# Altium schematic sheet Sheet_1_2025-11-09.schdoc
size 308 x 215 mm
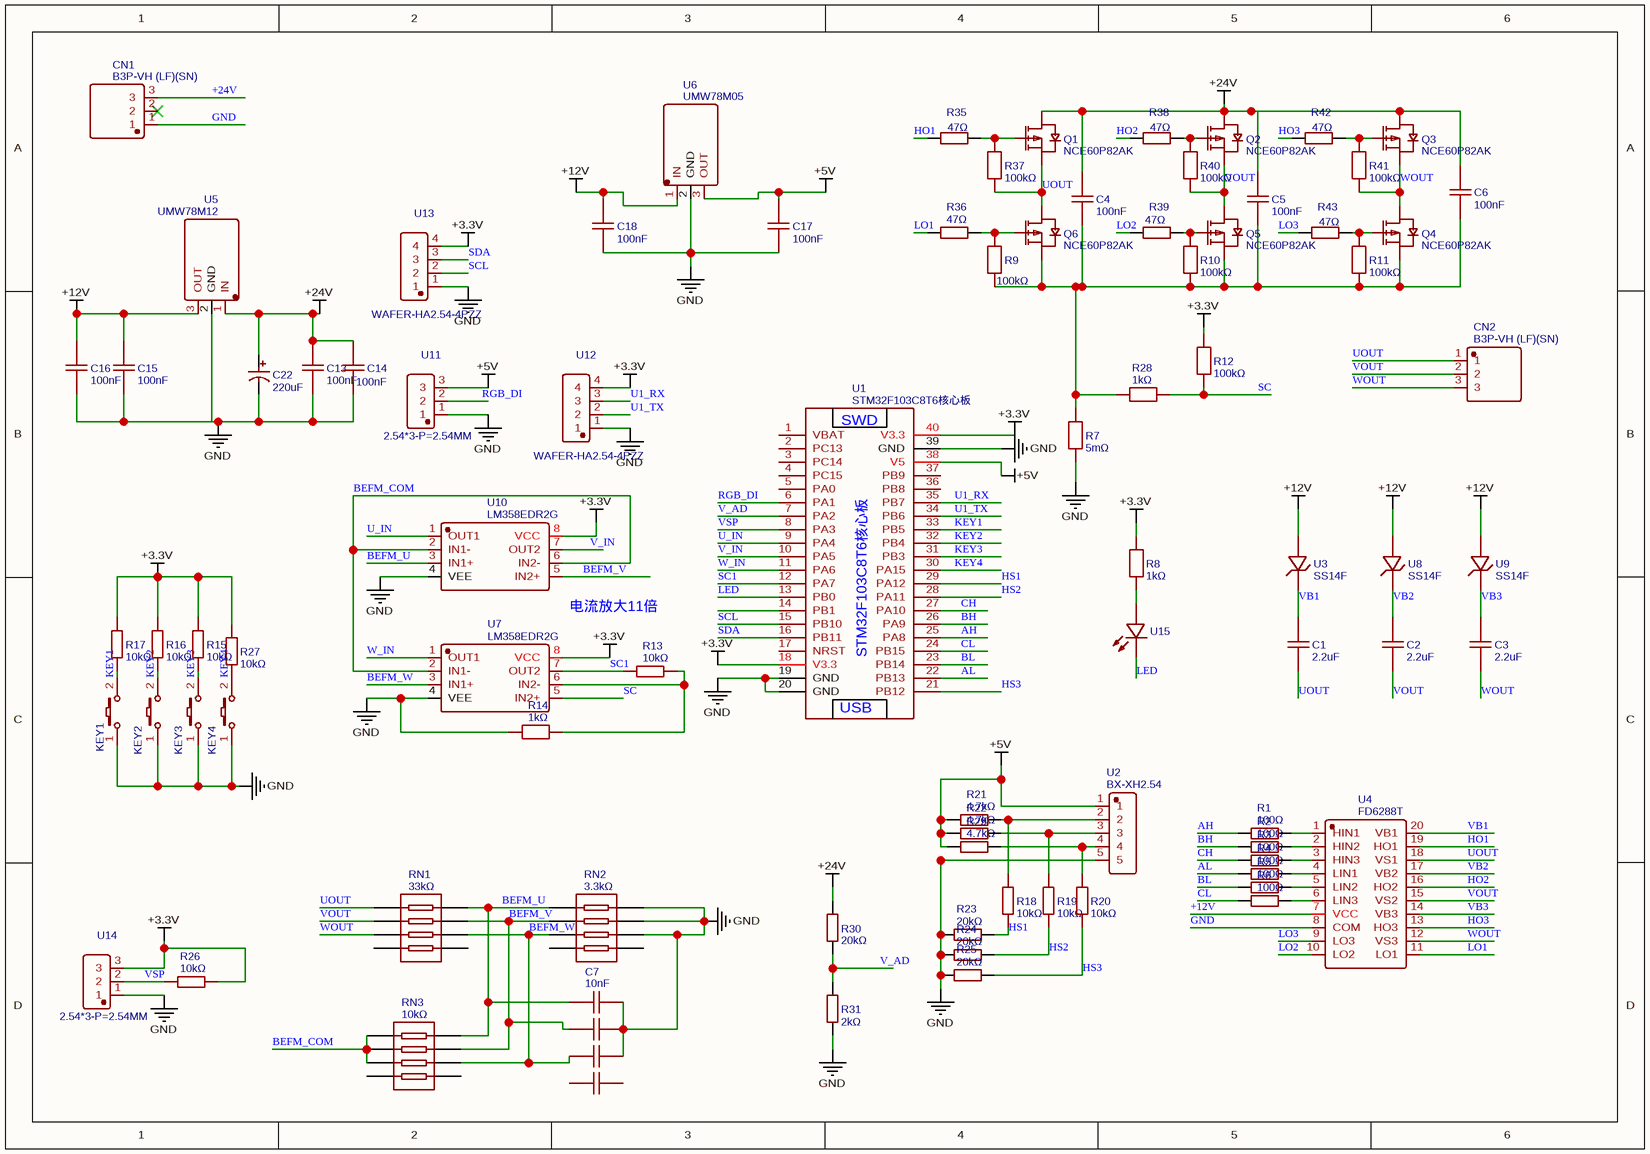
[diagram p0: Sheet_1_2025-11-09.schdoc]

## Parts
C1  2.2uF  [C0805]
C2  2.2uF  [C0805]
C3  2.2uF  [C0805]
C4  100nF  [C0603]
C5  100nF  [C0603]
C6  100nF  [C0603]
C7  10nF  [CAP-ARRAY-SMD_0612-8P-L3.40-W1.80-BL]
C13  100nF  [C0603]
C14  100nF  [C0603]
C15  100nF  [C0603]
C16  100nF  [C0603]
C17  100nF  [C0603]
C18  100nF  [C0603]
C22  220uF  [CAP-TH_BD13.0-P5.00-D1.2-FD]
CN1  B3P-VH (LF)(SN)  [CONN-TH_B3P-VH-LF-SN]
CN2  B3P-VH (LF)(SN)  [CONN-TH_B3P-VH-LF-SN]
KEY1  K2-3.6×6.1_SMD  [KEY-SMD_2P-L6.2-W3.6-LS8.0]  (value not drawn)
KEY2  K2-3.6×6.1_SMD  [KEY-SMD_2P-L6.2-W3.6-LS8.0]  (value not drawn)
KEY3  K2-3.6×6.1_SMD  [KEY-SMD_2P-L6.2-W3.6-LS8.0]  (value not drawn)
KEY4  K2-3.6×6.1_SMD  [KEY-SMD_2P-L6.2-W3.6-LS8.0]  (value not drawn)
Q1  NCE60P82AK  [TO-252-2_L6.6-W6.1-P4.57-LS10.1-BL-1]
Q2  NCE60P82AK  [TO-252-2_L6.6-W6.1-P4.57-LS10.1-BL-1]
Q3  NCE60P82AK  [TO-252-2_L6.6-W6.1-P4.57-LS10.1-BL-1]
Q4  NCE60P82AK  [TO-252-2_L6.6-W6.1-P4.57-LS10.1-BL-1]
Q5  NCE60P82AK  [TO-252-2_L6.6-W6.1-P4.57-LS10.1-BL-1]
Q6  NCE60P82AK  [TO-252-2_L6.6-W6.1-P4.57-LS10.1-BL-1]
R1  100Ω  [R0603]
R2  100Ω  [R0603]
R3  100Ω  [R0603]
R4  100Ω  [R0603]
R5  100Ω  [R0603]
R6  100Ω  [R0603]
R7  5mΩ  [R2512]
R8  1kΩ  [R0603]
R9  100kΩ  [R0603]
R10  100kΩ  [R0603]
R11  100kΩ  [R0603]
R12  100kΩ  [R0603]
R13  10kΩ  [R0603]
R14  1kΩ  [R0603]
R15  10kΩ  [R0603]
R16  10kΩ  [R0603]
R17  10kΩ  [R0603]
R18  10kΩ  [R0603]
R19  10kΩ  [R0603]
R20  10kΩ  [R0603]
R21  4.7kΩ  [R0603]
R22  4.7kΩ  [R0603]
R23  20kΩ  [R0603]
R24  20kΩ  [R0603]
R25  20kΩ  [R0603]
R26  10kΩ  [R0603]
R27  10kΩ  [R0603]
R28  1kΩ  [R0603]
R29  4.7kΩ  [R0603]
R30  20kΩ  [R0603]
R31  2kΩ  [R0603]
R35  47Ω  [R0603]
R36  47Ω  [R0603]
R37  100kΩ  [R0603]
R38  47Ω  [R0603]
R39  47Ω  [R0603]
R40  100kΩ  [R0603]
R41  100kΩ  [R0603]
R42  47Ω  [R0603]
R43  47Ω  [R0603]
RN1  33kΩ  [RES-ARRAY-SMD_0603-8P-L3.2-W1.6-BL]
RN2  3.3kΩ  [RES-ARRAY-SMD_0603-8P-L3.2-W1.6-BL]
RN3  10kΩ  [RES-ARRAY-SMD_0603-8P-L3.2-W1.6-BL]
U1  STM32F103C8T6核心板  [STM32F103C8T6核心板]
U2  BX-XH2.54  [CONN-TH_5P-P2.50_BX-XH2.54-5PZZ]
U3  SS14F  [SMAF_L3.5-W2.6-LS4.7-RD]
U4  FD6288T  [TSSOP-20_L6.5-W4.4-P0.65-LS6.4-BL]
U5  UMW78M12  [TO-252-2_L6.6-W6.1-P4.57-LS9.9-BR-CW]
U6  UMW78M05  [TO-252-2_L6.6-W6.1-P4.57-LS9.9-BR-CW]
U7  LM358EDR2G  [SOIC-8_L4.9-W3.9-P1.27-LS6.0-BL]
U8  SS14F  [SMAF_L3.5-W2.6-LS4.7-RD]
U9  SS14F  [SMAF_L3.5-W2.6-LS4.7-RD]
U10  LM358EDR2G  [SOIC-8_L4.9-W3.9-P1.27-LS6.0-BL]
U11  2.54*3-P=2.54MM  [CONN-TH_XH2.54-3P]
U12  WAFER-HA2.54-4PZZ  [CONN-TH_4P-P2.50-XH2.54-4P]
U13  WAFER-HA2.54-4PZZ  [CONN-TH_4P-P2.50-XH2.54-4P]
U14  2.54*3-P=2.54MM  [CONN-TH_XH2.54-3P]
U15  KO-0805_C9900066565  [LED0805-RD]  (value not drawn)

## Nets
+3.3V: R8.2 R12.2 R15.2 R16.2 R17.2 R26.1 R27.2 U1.18(V3.3) U1.40(V3.3) U7.8(VCC) U10.8(VCC) U12.4 U13.4 U14.3
+5V: C17.2 R21.2 R22.2 R29.2 U1.38(V5) U2.1 U6.3(OUT) U11.3
+12V: C15.2 C16.2 C18.2 U3.2(A) U4.7(VCC) U5.3(OUT) U6.1(IN) U8.2(A) U9.2(A)
+24V: C4.2 C5.2 C6.2 C13.2 C14.2 C22.1 CN1.3 Q1.2(D) Q2.2(D) Q3.2(D) R30.2 U5.1(IN)
GND: C7.2 C7.3 C7.4 C13.1 C14.1 C15.1 C16.1 C17.1 C18.1 C22.2 CN1.1 KEY1.1 KEY2.1 KEY3.1 KEY4.1 R7.1 R14.1 R23.2 R24.2 R25.2 R31.1 RN2.6 RN2.7 RN2.8 U1.19(GND) U1.20(GND) U1.39(GND) U2.5 U4.8(COM) U5.2(GND) U6.2(GND) U7.4(VEE) U10.4(VEE) U11.1 U12.1 U13.1 U14.1
AH: R1.1 U1.25(PA8)
AL: R4.1 U1.22(PB13)
BEFM_COM: RN3.5 RN3.6 RN3.7 U7.2(IN1-) U10.2(IN1-) U10.6(IN2-)
BEFM_U: C7.5 RN1.8 RN2.1 RN3.4 U10.3(IN1+)
BEFM_V: C7.6 RN1.7 RN2.2 RN3.3 U10.5(IN2+)
BEFM_W: C7.7 RN1.6 RN2.3 RN3.2 U7.3(IN1+)
BH: R2.1 U1.26(PA9)
BL: R5.1 U1.23(PB14)
CH: R3.1 U1.27(PA10)
CL: R6.1 U1.24(PB15)
HO1: R35.1 U4.19(HO1)
HO2: R38.1 U4.16(HO2)
HO3: R42.1 U4.13(HO3)
HS1: R18.1 R23.1 U1.29(PA12)
HS2: R19.1 R24.1 U1.28(PA11)
HS3: R20.1 R25.1 U1.21(PB12)
KEY1: KEY1.2 R17.1 U1.33(PB5)
KEY2: KEY2.2 R16.1 U1.32(PB4)
KEY3: KEY3.2 R15.1 U1.31(PB3)
KEY4: KEY4.2 R27.1 U1.30(PA15)
LED: U1.13(PB0) U15.1(K)
LO1: R36.1 U4.11(LO1)
LO2: R39.1 U4.10(LO2)
LO3: R43.1 U4.9(LO3)
RGB_DI: U1.6(PA1) U11.2
SC: R12.1 R28.2 U7.5(IN2+)
SC1: R13.1 U1.12(PA7) U7.7(OUT2)
SCL: U1.15(PB10) U13.2
SDA: U1.16(PB11) U13.3
U1_RX: U1.35(PB7) U12.3
U1_TX: U1.34(PB6) U12.2
U_IN: U1.9(PA4) U10.1(OUT1)
UOUT: C1.1 CN2.1 Q1.3(S) Q6.2(D) R37.1 RN1.1 U4.18(VS1)
V_AD: R30.1 R31.2 U1.7(PA2)
V_IN: U1.10(PA5) U10.7(OUT2)
VB1: C1.2 U3.1(C) U4.20(VB1)
VB2: C2.2 U4.17(VB2) U8.1(C)
VB3: C3.2 U4.14(VB3) U9.1(C)
VOUT: C2.1 CN2.2 Q2.3(S) Q5.2(D) R40.1 RN1.2 U4.15(VS2)
VSP: R26.2 U1.8(PA3) U14.2
W_IN: U1.11(PA6) U7.1(OUT1)
WOUT: C3.1 CN2.3 Q3.3(S) Q4.2(D) R41.1 RN1.3 U4.12(VS3)
NetC4_1: C4.1 C5.1 C6.1 Q4.3(S) Q5.3(S) Q6.3(S) R7.2 R9.1 R10.1 R11.1 R28.1
NetQ1_1: Q1.1(G) R35.2 R37.2
NetQ2_1: Q2.1(G) R38.2 R40.2
NetQ3_1: Q3.1(G) R41.2 R42.2
NetQ4_1: Q4.1(G) R11.2 R43.2
NetQ5_1: Q5.1(G) R10.2 R39.2
NetQ6_1: Q6.1(G) R9.2 R36.2
NetR1_2: R1.2 U4.1(HIN1)
NetR2_2: R2.2 U4.2(HIN2)
NetR3_2: R3.2 U4.3(HIN3)
NetR4_2: R4.2 U4.4(LIN1)
NetR5_2: R5.2 U4.5(LIN2)
NetR6_2: R6.2 U4.6(LIN3)
NetR8_1: R8.1 U15.2(A)
NetR13_2: R13.2 R14.2 U7.6(IN2-)
NetR18_2: R18.2 R21.1 U2.2
NetR19_2: R19.2 R22.1 U2.3
NetR20_2: R20.2 R29.1 U2.4

Not connected (* = marked no-connect by the designer): C7 1 8; CN1 2*; RN1 4 5; RN2 4 5; RN3 1 8; U1 1(VBAT) 2(PC13) 3(PC14) 4(PC15) 5(PA0) 14(PB1) 17(NRST) 36(PB8) 37(PB9)

## Notes on the sheet
- 电流放大11倍
- (near KEY1) KEY1
- (in symbol STM32F103C8T6核心板) SWD; USB

## Library data of the parts
C1-C3 = 2.2uF: Manufacturer: CCTC(三环); Manufacturer Part: TCC0805X5R225K250FT; nameAlias: Value; Contributor: lcsc; Supplier: LCSC; Supplier Part: C2903666; JLCPCB Part Class: Extended Part; spicePre: C; spiceSymbolName: TCC0805X5R225K250FT
C4-C6 = 100nF: Manufacturer: null; Manufacturer Part: CT41-0603-2F4-50V-0.1uF-M(N); nameAlias: Value; Contributor: LCSC; Supplier: LCSC; Supplier Part: C138344; JLCPCB Part Class: Extended Part; spicePre: C; spiceSymbolName: CT41-0603-2F4-50V-0.1UF-M(N)
C7 = 10nF: Manufacturer: YAGEO(国巨); Manufacturer Part: CA0612KRX7R9BB103; Contributor: LCSC; nameAlias: Value; Supplier: LCSC; Supplier Part: C700524; JLCPCB Part Class: Extended Part; link: https://so.szlcsc.com/global.html?k=C700524&ref=editor; spicePre: C; spiceSymbolName: CA0612KRX7R9BB103
C13-C18 = 100nF: Manufacturer: XINNA(新纳); Manufacturer Part: CT063X7R104KNTD; nameAlias: Value; Contributor: lcsc; Supplier: LCSC; Supplier Part: C41398819; link: https://so.szlcsc.com/global.html?k=C41398819&ref=editor; spicePre: C; spiceSymbolName: CT063X7R104KNTD
C22 = 220uF: Manufacturer: rubycon(红宝石); Manufacturer Part: 100PX220MEFC12.5X20; nameAlias: Value; Supplier: LCSC; Supplier Part: C88784; JLCPCB Part Class: Extended Part; link: https://so.szlcsc.com/global.html?k=C88784&ref=editor; spicePre: C; spiceSymbolName: 100PX220MEFC12.5X20
CN1 CN2 = B3P-VH (LF)(SN): Manufacturer: JST; Contributor: LCSC; Supplier: LCSC; Supplier Part: C160316; Manufacturer Part: B3P-VH(LF)(SN); JLCPCB Part Class: Extended Part; link: https://so.szlcsc.com/global.html?k=C160316&ref=editor; spicePre: C; spiceSymbolName: B3P-VH (LF)(SN)
KEY1-KEY4 = K2-3.6×6.1_SMD: Manufacturer Part: K2-1107ST-A4SW-06; Contributor: LCEDA_Lib; 制造商: 韩国韩荣; Supplier Part: C118141; Supplier: LCSC; spicePre: K; spiceSymbolName: K2-3.6×6.1_SMD
Q1-Q6 = NCE60P82AK: Manufacturer: NCE(无锡新洁能); Contributor: lcsc; Supplier: LCSC; Supplier Part: C2686573; Manufacturer Part: NCE60P82AK; JLCPCB Part Class: Extended Part; link: https://so.szlcsc.com/global.html?k=C2686573&ref=editor; spicePre: Q; spiceSymbolName: NCE60P82AK
R1-R6 = 100Ω: Manufacturer: UNI-ROYAL(厚声); Manufacturer Part: 0603WAF1000T5E; nameAlias: Value; Supplier: LCSC; Supplier Part: C22775; JLCPCB Part Class: Basic Part; link: https://so.szlcsc.com/global.html?k=C22775&ref=editor; spicePre: R; spiceSymbolName: 0603WAF1000T5E
R7 = 5mΩ: Manufacturer: Milliohm(毫欧); Manufacturer Part: HoLR2512-1.5W-100mR-1%-15ppm; nameAlias: Value; Contributor: LCSC; Supplier: LCSC; Supplier Part: C2885420; JLCPCB Part Class: Extended Part; spicePre: R; spiceSymbolName: HOLR2512-1.5W-100MR-1%-15PPM
R8 R28 = 1kΩ: Manufacturer: TE Connectivity(泰科电子); Manufacturer Part: CPF0603B10KE1; nameAlias: Value; Contributor: lcsc; Supplier: LCSC; Supplier Part: C4109781; JLCPCB Part Class: Extended Part; spicePre: R; spiceSymbolName: CPF0603B10KE1
R9-R11 R37 R40 R41 = 100kΩ: Manufacturer: Milliohm(毫欧); Manufacturer Part: HoAR0603-1/10W-100KR-1%-TCR25; nameAlias: Value; Contributor: lcsc; Supplier: LCSC; Supplier Part: C2912579; JLCPCB Part Class: Extended Part; spicePre: R; spiceSymbolName: HOAR0603-1/10W-100KR-1%-TCR25
R12 = 100kΩ: Manufacturer: TE Connectivity(泰科电子); Manufacturer Part: CPF0603B10KE1; nameAlias: Value; Contributor: lcsc; Supplier: LCSC; Supplier Part: C4109781; JLCPCB Part Class: Extended Part; spicePre: R; spiceSymbolName: CPF0603B10KE1
R13 R15-R20 R26 R27 = 10kΩ: Manufacturer: Tyohm(幸亚电阻); Manufacturer Part: RMC060310KFN; nameAlias: Value; Contributor: LCSC; Supplier: LCSC; Supplier Part: C269701; JLCPCB Part Class: Extended Part; link: https://so.szlcsc.com/global.html?k=C269701&ref=editor; spicePre: R; spiceSymbolName: RMC060310K1%N
R14 = 1kΩ: Manufacturer: VO(翔胜); Manufacturer Part: FCR0603F1K; nameAlias: Value; Contributor: lcsc; Supplier: LCSC; Supplier Part: C5913168; JLCPCB Part Class: Extended Part; link: https://so.szlcsc.com/global.html?k=C5913168&ref=editor; spicePre: R; spiceSymbolName: FCR0603F1K
R21 R22 R29 = 4.7kΩ: Manufacturer: UNI-ROYAL(厚声); Manufacturer Part: 0603WAF4701T5E; nameAlias: Value; Supplier: LCSC; Supplier Part: C23162; JLCPCB Part Class: Basic Part; link: https://so.szlcsc.com/global.html?k=C23162&ref=editor; spicePre: R; spiceSymbolName: 0603WAF4701T5E
R23-R25 R30 = 20kΩ: Manufacturer: UNI-ROYAL(厚声); Manufacturer Part: 0603WAF2002T5E; nameAlias: Value; Supplier: LCSC; Supplier Part: C4184; JLCPCB Part Class: Basic Part; link: https://so.szlcsc.com/global.html?k=C4184&ref=editor; spicePre: R; spiceSymbolName: 0603WAF2002T5E
R31 = 2kΩ: Manufacturer: UNI-ROYAL(厚声); Manufacturer Part: 0603WAF2001T5E; nameAlias: Value; Supplier: LCSC; Supplier Part: C22975; JLCPCB Part Class: Basic Part; link: https://so.szlcsc.com/global.html?k=C22975&ref=editor; spicePre: R; spiceSymbolName: 0603WAF2001T5E
R35 R36 R38 R39 R42 R43 = 47Ω: Manufacturer: UNI-ROYAL(厚声); Manufacturer Part: 0603WAF470JT5E; nameAlias: Value; Supplier: LCSC; Supplier Part: C23182; JLCPCB Part Class: Basic Part; link: https://so.szlcsc.com/global.html?k=C23182&ref=editor; spicePre: R; spiceSymbolName: 0603WAF470JT5E
RN1 = 33kΩ: Manufacturer: UNI-ROYAL(厚声); Manufacturer Part: 4D03WGJ0333T5E; nameAlias: Value; Supplier: LCSC; Supplier Part: C25732; JLCPCB Part Class: Extended Part; link: https://so.szlcsc.com/global.html?k=C25732&ref=editor; spicePre: R; spiceSymbolName: 4D03WGJ0333T5E
RN2 = 3.3kΩ: Manufacturer: UNI-ROYAL(厚声); Manufacturer Part: 4D03WGJ0333T5E; nameAlias: Value; Supplier: LCSC; Supplier Part: C25732; JLCPCB Part Class: Extended Part; link: https://so.szlcsc.com/global.html?k=C25732&ref=editor; spicePre: R; spiceSymbolName: 4D03WGJ0333T5E
RN3 = 10kΩ: Manufacturer: FH(风华); Manufacturer Part: RC-ML08W103JT; nameAlias: Value; Contributor: LCSC; Supplier: LCSC; Supplier Part: C69593; JLCPCB Part Class: Extended Part; link: https://so.szlcsc.com/global.html?k=C69593&ref=editor; spicePre: R; spiceSymbolName: RC-ML08W103JT
U1 = STM32F103C8T6核心板: Manufacturer: 无; Manufacturer Part: STM32F103C8T6最小系统模块; subpart_no: 1; tags: STM32; Contributor: Kolin; timeStamp: 1455028086; Supplier Part: C8734; image: http://image.lceda.cn/szlcsc/C8734.jpg; spicePre: U; spiceSymbolName: STM32F103C8T6核心板
U2 = BX-XH2.54: Manufacturer: Bossie(博锡); Manufacturer Part: BX-XH2.54-5PZZ; Contributor: lcsc; Supplier: LCSC; Supplier Part: C18077836; JLCPCB Part Class: Extended Part; link: https://so.szlcsc.com/global.html?k=C18077836&ref=editor; spicePre: U; spiceSymbolName: BX-XH2.54-5PZZ
U3 U8 U9 = SS14F: Manufacturer: GOODWORK(固得沃克); Contributor: lcsc; Supplier: LCSC; Supplier Part: C908666; Manufacturer Part: SS14F; JLCPCB Part Class: Extended Part; link: https://so.szlcsc.com/global.html?k=C908666&ref=editor; spicePre: U; spiceSymbolName: SS14F_C908666
U4 = FD6288T: Manufacturer: JSMSEMI(杰盛微); Contributor: lcsc; Supplier: LCSC; Supplier Part: C5804616; Manufacturer Part: FD6288T; JLCPCB Part Class: Extended Part; spicePre: U; spiceSymbolName: FD6288T
U5 = UMW78M12: Manufacturer: UMW(友台半导体); Manufacturer Part: 78M12; Contributor: LCSC; Supplier: LCSC; Supplier Part: C347282; JLCPCB Part Class: Extended Part; link: https://so.szlcsc.com/global.html?k=C347282&ref=editor; spicePre: U; spiceSymbolName: UMW78M12
U6 = UMW78M05: Manufacturer: UMW(友台半导体); Manufacturer Part: 78M05; Contributor: LCSC; Supplier: LCSC; Supplier Part: C347278; JLCPCB Part Class: Extended Part; link: https://so.szlcsc.com/global.html?k=C347278&ref=editor; spicePre: U; spiceSymbolName: UMW78M05
U7 U10 = LM358EDR2G: Manufacturer: onsemi(安森美); Contributor: LCSC; Supplier: LCSC; Supplier Part: C117585; Manufacturer Part: LM358EDR2G; JLCPCB Part Class: Extended Part; link: https://so.szlcsc.com/global.html?k=C117585&ref=editor; spicePre: U; spiceSymbolName: LM358EDR2G
U11 U14 = 2.54*3-P=2.54MM: Manufacturer: null; Contributor: LCSC; Supplier: LCSC; Supplier Part: C9900005597; Manufacturer Part: 2.54*3-P=2.54mm; JLCPCB Part Class: Extended Part; link: https://so.szlcsc.com/global.html?k=C9900005597&ref=editor; spicePre: U; spiceSymbolName: 2.54*3-P=2.54MM
U12 U13 = WAFER-HA2.54-4PZZ: Manufacturer: XUNPU(讯普); Contributor: lcsc; Supplier: LCSC; Supplier Part: C5359651; Manufacturer Part: WAFER-HA2.54-4PZZ; JLCPCB Part Class: Extended Part; link: https://so.szlcsc.com/global.html?k=C5359651&ref=editor; spicePre: U; spiceSymbolName: WAFER-HA2.54-4PZZ
U15 = KO-0805_C9900066565: Manufacturer: null; Contributor: lcsc; Supplier: LCSC; Supplier Part: C9900066565; Manufacturer Part: KO-0805; JLCPCB Part Class: Extended Part; link: https://so.szlcsc.com/global.html?k=C9900066565&ref=editor; spicePre: U; spiceSymbolName: KO-0805_C9900066565